# EAGLE schematic USB_power (EAGLE 6.6.0)
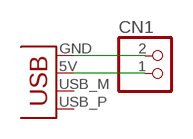
[diagram p0: schematic, sheet 1]

## Parts
CN1  JST_2PIN-SMT-RA  [JST-PH-2-SMT-RA]
JP1  USBPCB  [USB-A-PCB]

## Nets
N$1: CN1.2 JP1.GND
N$2: CN1.1 JP1.5V(VBUS)
Unconnected: JP1.USB_M(D-) JP1.USB_P(D+)

## Library data of the parts
CN1 = adafruit:JST_2PIN: JST 2-Pin Connectors of various flavors SMT-RA (S2B-PH-SM4) 4UConnector #17311 SMT (B2B-PH-SM4) THM-RA (S2B-PH) THM (B2B-PH)
JP1 = SparkFun-Connectors:USB: USB Connectors USB-B-PTH is fully proven SKU : PRT-00139/CONN-08278 USB-miniB is fully proven SKU : PRT-00587 USB-A-PCB is untested. USB-A-H is throughly reviewed, but untested. Spark Fun Electronics SKU : PRT-00437 USB-B-SMT is throughly reviewed, but untested. Needs silkscreen touching up. USB-A-S has not been used/tested USB-MB-H has not been used/tested USB-MICROB has been used. CONN-09505